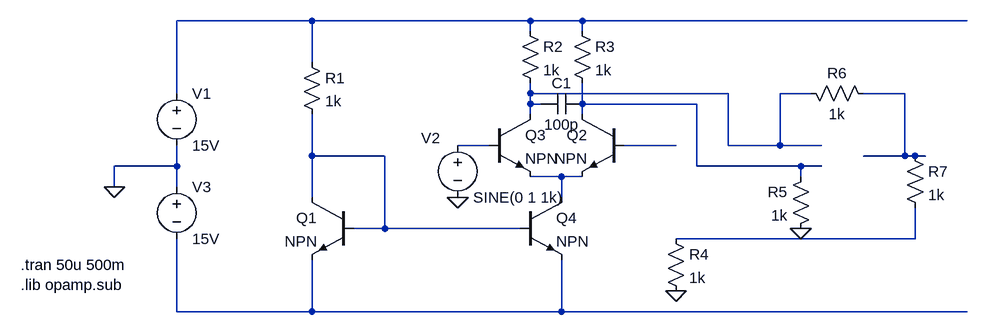
[diagram p0: schematic Draft1.asc]
Draft1.asc, the LTspice schematic file:
Version 4
SHEET 1 932 680
WIRE -80 144 -288 144
WIRE 256 144 -80 144
WIRE 336 144 256 144
WIRE 928 144 336 144
WIRE 256 160 256 144
WIRE 336 160 336 144
WIRE -80 208 -80 144
WIRE -288 256 -288 144
WIRE 256 256 256 240
WIRE 560 256 256 256
WIRE 688 256 640 256
WIRE 832 256 768 256
WIRE 256 272 256 256
WIRE 272 272 256 272
WIRE 336 272 336 240
WIRE 512 272 336 272
WIRE 256 288 256 272
WIRE 336 288 336 272
WIRE 192 336 144 336
WIRE 480 336 400 336
WIRE 560 336 560 256
WIRE 640 336 640 256
WIRE 640 336 560 336
WIRE 704 336 640 336
WIRE -80 352 -80 288
WIRE 32 352 -80 352
WIRE 832 352 832 256
WIRE 832 352 768 352
WIRE 848 352 832 352
WIRE 864 352 848 352
WIRE -288 368 -288 336
WIRE -288 368 -384 368
WIRE 512 368 512 272
WIRE 672 368 512 368
WIRE 704 368 672 368
WIRE 304 384 256 384
WIRE 336 384 304 384
WIRE 672 384 672 368
WIRE -384 400 -384 368
WIRE -288 400 -288 368
WIRE -80 416 -80 352
WIRE 304 416 304 384
WIRE 32 464 32 352
WIRE 32 464 -16 464
WIRE 240 464 32 464
WIRE 848 480 848 432
WIRE 848 480 480 480
WIRE -288 592 -288 480
WIRE -80 592 -80 512
WIRE -80 592 -288 592
WIRE 304 592 304 512
WIRE 304 592 -80 592
WIRE 928 592 304 592
FLAG 480 560 0
FLAG 144 416 0
FLAG 672 464 0
FLAG -384 400 0
SYMBOL voltage -288 240 R0
SYMATTR InstName V1
SYMATTR Value 15V
SYMBOL npn -16 416 M0
SYMATTR InstName Q1
SYMBOL res -96 192 R0
SYMATTR InstName R1
SYMATTR Value 1k
SYMBOL npn 400 288 M0
SYMATTR InstName Q2
SYMBOL npn 192 288 R0
SYMATTR InstName Q3
SYMBOL npn 240 416 R0
SYMATTR InstName Q4
SYMBOL res 240 144 R0
SYMATTR InstName R2
SYMATTR Value 1k
SYMBOL res 320 144 R0
SYMATTR InstName R3
SYMATTR Value 1k
SYMBOL res 464 464 R0
SYMATTR InstName R4
SYMATTR Value 1k
SYMBOL voltage 144 320 R0
WINDOW 0 -56 5 Left 2
SYMATTR InstName V2
SYMATTR Value SINE(0 1 1k)
SYMBOL cap 336 288 M270
WINDOW 0 32 32 VTop 2
WINDOW 3 0 32 VBottom 2
SYMATTR InstName C1
SYMATTR Value 100p
SYMBOL res 688 368 M0
SYMATTR InstName R5
SYMATTR Value 1k
SYMBOL res 784 272 M270
WINDOW 0 32 56 VTop 2
WINDOW 3 0 56 VBottom 2
SYMATTR InstName R6
SYMATTR Value 1k
SYMBOL res 832 336 R0
SYMATTR InstName R7
SYMATTR Value 1k
SYMBOL voltage -288 384 R0
SYMATTR InstName V3
SYMATTR Value 15V
TEXT -528 520 Left 2 !.tran 50u 500m\n.lib opamp.sub

The netlist it stands for:
* Draft1.asc
V1 N001 0 15V
Q1 N007 N007 N010 0 NPN
R1 N001 N007 1k
Q2 N004 N006 N008 0 NPN
Q3 N002 N005 N008 0 NPN
Q4 N008 N007 N010 0 NPN
R2 N001 N002 1k
R3 N001 N004 1k
R4 N009 0 1k
V2 N005 0 SINE(0 1 1k)
C1 N004 N002 100p
R5 N004 0 1k
R6 N003 N002 1k
R7 N003 N009 1k
V3 0 N010 15V
.model NPN NPN
.model PNP PNP
.lib standard.bjt
.tran 50u 500m
.lib opamp.sub
.backanno
.end